# Altium schematic sheet PCB_Power.SchDoc
size A4; DocumentNumber: 5; SheetNumber: 5; SheetTotal: 8
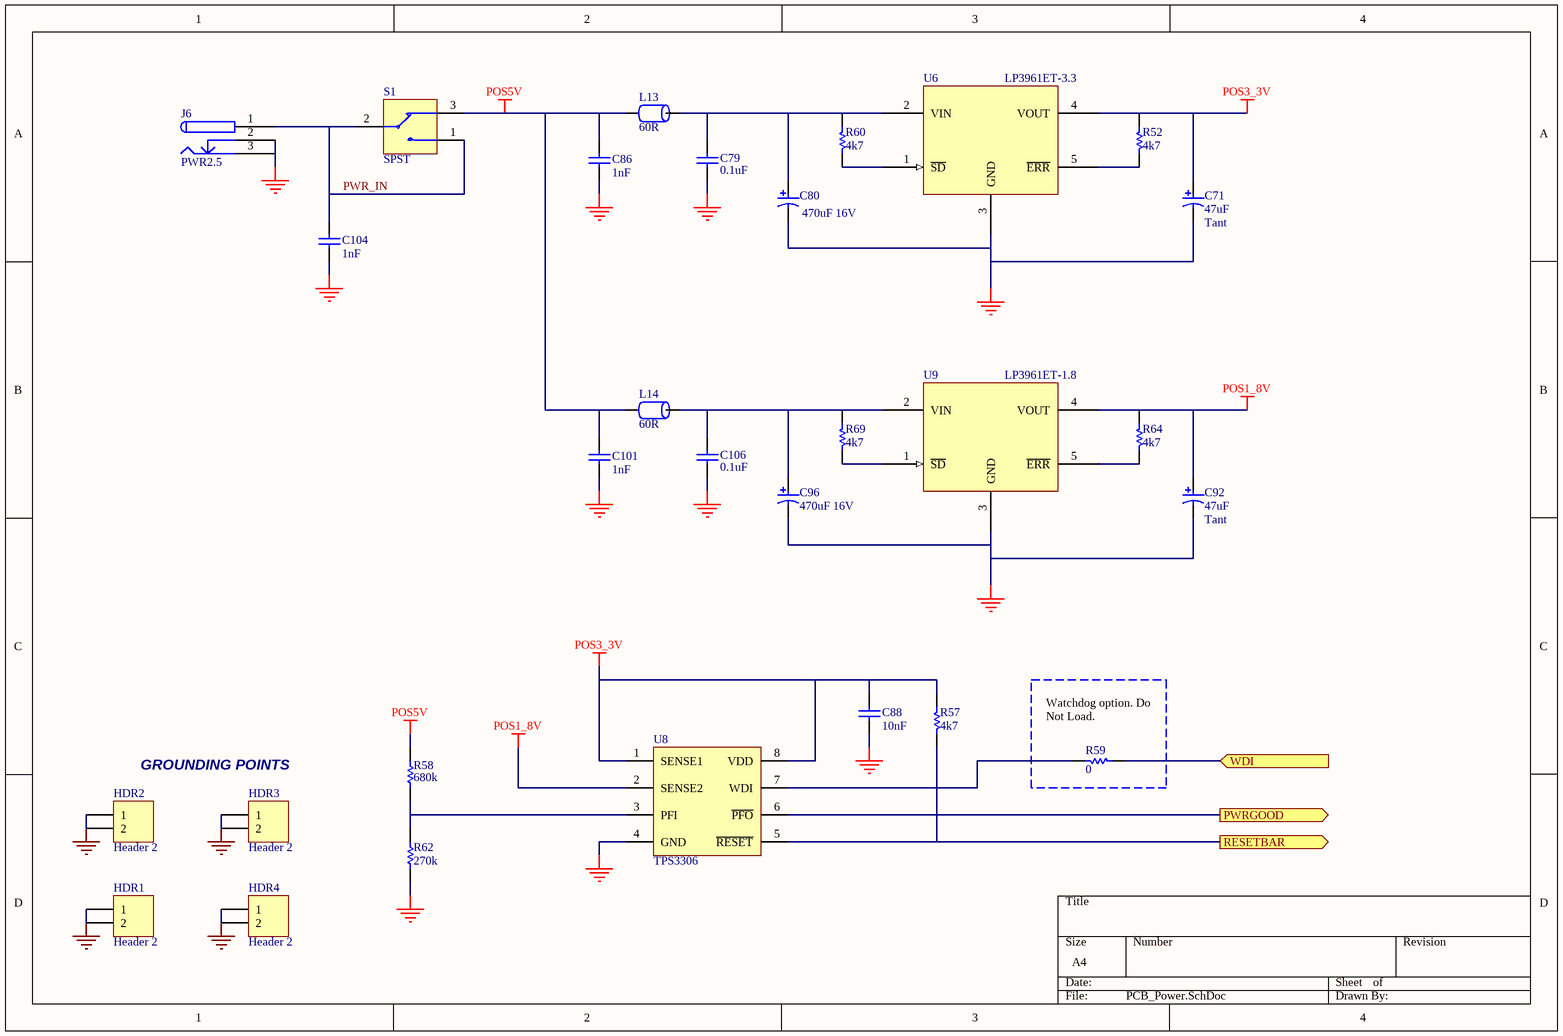
[diagram p0: PCB_Power.SchDoc]

## Parts
C71  47uF  Capacitor Type: Tant  [MCCTD]
C79  0.1uF  [CC2012-0805]
C80  470uF 16V  [RB8/3.5]
C86  1nF  [CC2012-0805]
C88  10nF  [CC2012-0805]
C92  47uF  Capacitor Type: Tant  [MCCTD]
C96  470uF 16V  [RB8/3.5]
C101  1nF  [CC2012-0805]
C104  1nF  [CC2012-0805]
C106  0.1uF  [CC2012-0805]
HDR1  Header 2  [HDR1X2]
HDR2  Header 2  [HDR1X2]
HDR3  Header 2  [HDR1X2]
HDR4  Header 2  [HDR1X2]
J6  PWR2.5  [PWR2.5]
L13  60R  [CC2012-0805]
L14  60R  [CC2012-0805]
R52  4k7  [CC2012-0805]
R57  4k7  [CC2012-0805]
R58  680k  [CC2012-0805]
R59  0  [CC2012-0805]
R60  4k7  [CC2012-0805]
R62  270k  [CC2012-0805]
R64  4k7  [CC2012-0805]
R69  4k7  [CC2012-0805]
S1  SPST  [PCB_SWITCH]
U6  LP3961ET-3.3  [TO220-5V]
U8  TPS3306  [SOIC8]
U9  LP3961ET-1.8  [TO220-5V]

## Ports
PWRGOOD (out), RESETBAR (out), WDI (in)

## Nets
GND: C71.2 C79.2 C80.2 C86.2 C88.2 C92.2 C96.2 C101.2 C104.2 C106.2 HDR1.1 HDR1.2 HDR2.1 HDR2.2 HDR3.1 HDR3.2 HDR4.1 HDR4.2 J6.2 J6.3 R62.2 U6.3(GND) U8.4(GND) U9.3(GND)
POS1_8V: C92.1 R64.2 U8.2(SENSE2) U9.4(VOUT)
POS3_3V: C71.1 C88.1 R52.2 R57.2 U6.4(VOUT) U8.1(SENSE1) U8.8(VDD)
POS5V: C86.1 C101.1 L13.1 L14.1 R58.1 S1.3
PWR_IN: C104.1 J6.1 S1.1 S1.2
PWRGOOD: U8.6(~{PFO}) ; port PWRGOOD
RESETBAR: R57.1 U8.5(~{RESET}) ; port RESETBAR
WDI: R59.1 ; port WDI
NetC79_1: C79.1 C80.1 L13.2 R60.2 U6.2(VIN)
NetC96_1: C96.1 C106.1 L14.2 R69.2 U9.2(VIN)
NetR52_1: R52.1 U6.5(~{ERR})
NetR58_2: R58.2 R62.1 U8.3(PFI)
NetR59_2: R59.2 U8.7(WDI)
NetR60_1: R60.1 U6.1(~{SD})
NetR64_1: R64.1 U9.5(~{ERR})
NetR69_1: R69.1 U9.1(~{SD})

## Notes on the sheet
- GROUNDING POINTS
- (near R59) Watchdog option. Do Not Load.

## Library data of the parts
C71 C80 C92 C96 = CAP_POLAR: Polar Capacitor; Fitted: True
C79 C86 C88 C101 C104 C106 = CAP: Capacitor; Fitted: True
HDR1-HDR4 = Header 2: Header, 2-Pin; Manufacturer: Generic Components; Class I: Connector; Fitted: True; Revision: July-2002: Re-released for DXP Platform.; Publisher: Altium Limited
J6 = PWR2.5: Low Voltage Power Supply Sonnector; Fitted: True
L13 L14 = FERRITE_BEAD: BMB Series Ferrite Chip Bead
R52 R57-R60 R62 R64 R69 = RES: Resistor; Fitted: True
S1 = PCB_MOUNT_SWITCH: SPDT Subminiature Toggle Switch; Fitted: True
U6 U9 = LP3961ET: 800mA Fast UL Dropout Regulator
U8 = TPS3306: TI Dual Voltage MPU Supervisory Circuit